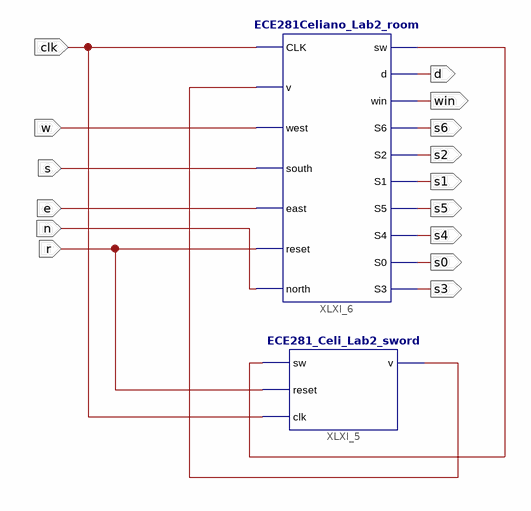
[diagram p0: schematic sheet 1]
// Xilinx ISE schematic ECE281_Celiano_Lab2_Top.sch (spartan3e) as structural Verilog: 2 symbols, 15 ports
module ECE281_Celiano_Lab2_Top (
  input  clk,
  input  r,
  input  w,
  input  s,
  input  e,
  input  n,
  output d,
  output s6,
  output s2,
  output s1,
  output s4,
  output s3,
  output s5,
  output s0,
  output win
);

  wire XLXN_2, XLXN_13;

  ECE281_Celi_Lab2_sword XLXI_5 (.sw(XLXN_13), .reset(r), .clk(clk), .v(XLXN_2));
  ECE281Celiano_Lab2_room XLXI_6 (
    .CLK(clk), .v(XLXN_2), .west(w), .south(s), .east(e), .reset(r), .north(n), .sw(XLXN_13), .d(d),
    .win(win), .S6(s6), .S2(s2), .S1(s1), .S5(s5), .S4(s4), .S0(s0), .S3(s3));
endmodule
